# Altium schematic sheet Sheet1.SchDoc
size A4
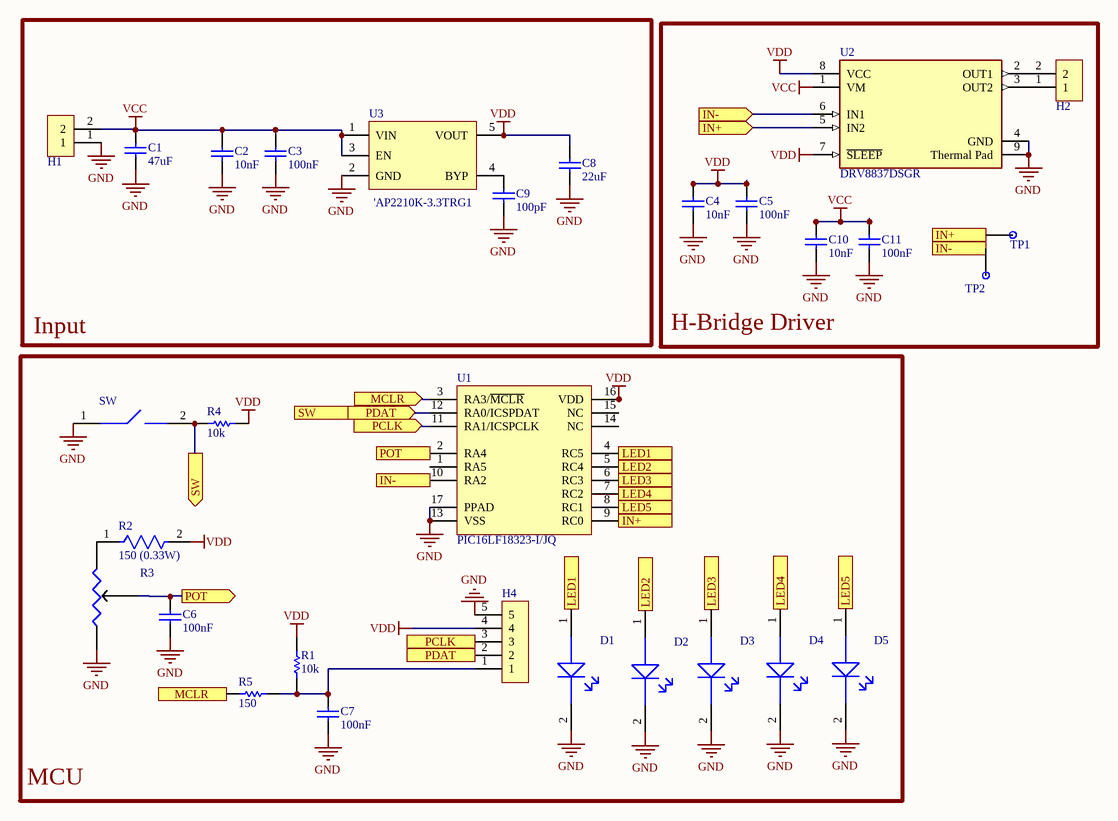
[diagram p0: Sheet1.SchDoc]

## Parts
C1  47uF  [TAYO-C1210-2_L]
C2  10nF  [CAPC1005X56X25ML10T15]
C3  100nF  [CAPC1005X56X25ML10T15]
C4  10nF  [CAPC1005X56X25ML10T15]
C5  100nF  [CAPC1005X56X25ML10T15]
C6  100nF  [CAPC1005X56X25ML10T15]
C7  100nF  [CAPC1005X56X25ML10T15]
C8  22uF  [CAPC1005X56X25ML10T15]
C9  100pF  [CAPC1005X56X25ML10T15]
C10  10nF  [CAPC1005X56X25ML10T15]
C11  100nF  [CAPC1005X56X25ML10T15]
D1  'LTST-C190KFKT  [RESC1608X04N]  (value not drawn)
D2  'LTST-C190KFKT  [RESC1608X04N]  (value not drawn)
D3  'LTST-C190KFKT  [RESC1608X04N]  (value not drawn)
D4  'LTST-C190KFKT  [RESC1608X04N]  (value not drawn)
D5  'LTST-C190KFKT  [RESC1608X04N]  (value not drawn)
H1  'BG300-02-A-L-A  [BG300-02-A-L-A]  (value not drawn)
H2  'BG300-02-A-L-A  [BG300-02-A-L-A]  (value not drawn)
H4  H5P1.27  [H5P1.27P]  (value not drawn)
R1  10k  [RESC1005X40X25ML5T10]
R2  150 (0.33W)  [FP-CRCW0603-HPe3-MFG]
R3  N6L50T0S-503A3030R-E  [N6L50T0S-503A3030R-E]  (value not drawn)
R4  10k  [RESC1005X40X25ML5T10]
R5  150  [RESC1005X40X25ML05T10]
SW  PTS815 SJK 250 SMTR LFS  [PTS815 SJK 250 SMTR LFS]  (value not drawn)
TP1  TESTPAD  [TESTPAD]  (value not drawn)
TP2  TESTPAD  [TESTPAD]  (value not drawn)
U1  PIC16LF18323-I/JQ  [PIC16F18323-I/JQ]
U2  DRV8837DSGR  [FP-DSG0008A-MFG]
U3  'AP2210K-3.3TRG1  [SOT95P282X145-5N]

## Blocks framed on the sheet
Input: C1-C3 C8 C9 H1 U3
H-Bridge Driver: C4 C5 C10 C11 H2 TP1 TP2 U2
MCU: C6 C7 D1-D5 H4 R1-R5 SW U1

## Ports
IN+ (in), IN+ (out), IN- (in), IN- (out), LED1 (in), LED1 (out), LED2 (in), LED2 (out), LED3 (in), LED3 (out), LED4 (in), LED4 (out), LED5 (in), LED5 (out), MCLR (in), MCLR (out), PCLK (in), PCLK (out), PDAT (in), PDAT (out), POT (in), POT (out), SW (in), SW (out)

## Nets
GND: C1.1 C2.1 C3.1 C4.1 C5.1 C6.1 C7.1 C8.1 C9.1 C10.1 C11.1 D1.2 D2.2 D3.2 D4.2 D5.2 H1.1 H4.5 R3.3 SW.1 U1.13(VSS) U1.17(PPAD) U2.4(GND) U2.9(Thermal_Pad) U3.2(GND)
VCC: C1.2 C2.2 C3.2 C10.2 C11.2 H1.2 U2.1(VM) U3.1(VIN) U3.3(EN)
VDD: C4.2 C5.2 C8.2 H4.4 R1.1 R2.2 R4.2 U1.16(VDD) U2.7(~{SLEEP}) U2.8(VCC) U3.5(VOUT)
IN+: TP1.1 U1.9(RC0) U2.5(IN2) ; port IN+
IN-: TP2.1 U1.10(RA2) U2.6(IN1) ; port IN-
LED1: D1.1 U1.4(RC5) ; port LED1
LED2: D2.1 U1.5(RC4) ; port LED2
LED3: D3.1 U1.6(RC3) ; port LED3
LED4: D4.1 U1.7(RC2) ; port LED4
LED5: D5.1 U1.8(RC1) ; port LED5
MCLR: R5.2 U1.3(RA3/~{MCLR}) ; port MCLR
PCLK: H4.3 U1.11(RA1/ICSPCLK) ; port PCLK
PDAT: H4.2 R4.1 SW.2 U1.12(RA0/ICSPDAT) ; port PDAT, port SW
POT: C6.2 R3.1 U1.2(RA4) ; port POT
NetC7_2: C7.2 H4.1 R1.2 R5.1
NetC9_2: C9.2 U3.4(BYP)
NetH2_1: H2.1 U2.3(OUT2)
NetH2_2: H2.2 U2.2(OUT1)
NetR2_1: R2.1 R3.2

Not connected (* = marked no-connect by the designer): U1 1(RA5) 14(NC) 15(NC)

## Library data of the parts
C1 = CMP-2000-06559-1: 'CL32A476KOJNNNE; Manufacturer: Taiyo Yuden; Capacitance: 47µF; Voltage - Rated: 10V; Other Names: 587-2783-6; Online Catalog: MSeries; Tolerance: ±20%; Temperature Coefficient: X7R; Applications: GeneralPurpose; Lead Spacing: -; Mounting Technology: SurfaceMount; Height - Seated (Max): -; Thickness (Max): 0.106"(2.70mm); Mounting Type: SurfaceMount,MLCC; Package / Case: 1210(3225Metric); Lead Style: -; Manufacturer URL: http://www.t-yuden.com/; Size / Dimension: 0.126"Lx0.098"W(3.20mmx2.50mm); Datasheet Version: 10/2014; Packaging: Digi-Reel®; Category: Capacitors; Datasheet URL: https://datasheet.ciiva.com/142/lmk325b7476mm-tr-ss-142765.pdf; Features: -; Package Reference: C1210; Package Description: 2-Pin Surface Mount Device, Body 3.2 x 2.5 mm, Height 2.7 mm; Series: M; Family: CeramicCapacitors; Operating Temperature: -55°C~125°C; Standard Package: 1; Ratings: -
C2 C4 C10 = CMP-2008-02799-1: '04025C103MAT2A; Manufacturer: AVX Interconnect / Elco; Part Number: 0402YC103MAT2A
C3 C5-C7 C11 = CMP-2008-02800-1: 'CL05B104KA5NNNC; Manufacturer: AVX Interconnect / Elco; Part Number: 0402YC104KAT2A
C8 = CMP-2008-02800-1: 'LMK105BJ225MV-F; Manufacturer: AVX Interconnect / Elco; Part Number: 0402YC104KAT2A
C9 = CMP-2008-02799-1: 'CC0402KRX7R9BB101; Manufacturer: AVX Interconnect / Elco; Part Number: 0402YC103MAT2A
D1-D5 = LED
H1 H2 = H2P2.54
R1 R4 = CMP-2002-07915-2: 'RC0402JR-0710KL; Resistance: 10 kohm; Voltage Rating (DC): 50 V; Power Rating: 63 mW; Tolerance: 5%; Case\Package: 0402; RoHSCompliant: true; DatasheetVersion: Rev. 4, 02/2016; ComponentLink1Description: Manufacturer URL; PackageDescription: 2-Pin Surface Mount Device, Body 1 x 0.5 mm; Case Code (Imperial): 0402; PackageReference: 0402; ComponentLink1URL: http://www.yageo.com/; Mounting Technology: Surface Mount; REACH SVHC: No SVHC; ComponentLink2Description: Datasheet; Case Code (Metric): 1005; Width: 0.5 mm; Package Quantity: 10000; Packaging: Tape and Reel; Max Operating Temperature: 155 degC; Mount: Surface Mount; Length: 1 mm; ComponentLink2URL: http://www.yageo.com/documents/recent/PYu-RC_Group_51_RoHS_L_04.pdf; Height: 0.35 mm; Voltage Rating: 50 V; Pins: 2; Min Operating Temperature: -55 degC
R2 = CMP-02407-010710-1: 'CRCW0603150RJNEAHP; Voltage Rating: 75V; Tolerance: 1%; Power Rating: 250mW; Temperature Coefficient: 100ppm/°C; Resistance: 150R; Case Code (Metric): 1608; Voltage Rating (DC): 75V; Packaging: Tape and Reel; Composition: Thick Film; Width: 0.033inch; Military Standard: Not; Max Operating Temperature: 155°C; Contact Plating: Tin; Case/Package: 0603; Features: Automotive AEC-Q200; Depth: 0.85mm; Height: 0.45mm; Package Quantity: 1; Case Code (Imperial): 0603; Max Power Dissipation: 250mW; Lead Free: Lead Free; Min Operating Temperature: -55°C; Radiation Hardening: No; Mount: Surface Mount; Weight: 7.1E-05oz; Termination: SMD/SMT; Number of Terminations: 2; Length: 1.55mm
R5 = CMP-2002-07401-1: 'RC0402FR-07150RL; Manufacturer: Yageo / Phycomp; Part Number: RC0402FR-07150RL
U1 = PIC16F18323-I/JQ
U2 = CMP-04915-000004-1: IC MOTOR DRIVER PAR 8WSON; Manufacturer: Texas Instruments; Switching Frequency: 0-250kHz; Min Supply Voltage: 1.8V; Standoff Height: 0mm; Max Supply Voltage: 7V; Output Voltage: 0-11V; Motor Type: Brushed; Number Of Outputs: 2; Output Current: 1.8A; Max Junction Temp: +150°C; Nominal Supply Current: 300-700uA; Mouser Description: Motor / Motion / Ignition Controllers & Drivers 1.8A Low Vltg Brush DC Motor Driver; Device Class L2: Power Management ICs; Manufacturer Part Number: DRV8837DSGR; Temperature Range Low: -40°C; Lead Free: Yes; Height: 0.8mm; Device Class L3: Motor Drivers; Octopart: https://octopart.com/drv8837dsgr-texas+instruments-23786726; Package: DSG0008A; ComponentLink2URL: http://www.ti.com/lit/ds/symlink/drv8837.pdf; Temperature: -40°C to +85°C; Ambient Temperature Range Low: -40°C; ComponentLink2Description: Datasheet; Ambient Temperature Range High: +85°C; Device Class L1: Integrated Circuits (ICs); Category: IC; Temperature Range High: +85°C; RoHS: TRUE; Automotive: No; Digikey Description: IC MOTOR DRIVER PAR 8WSON
U3 = AP2210K-3.0TRG1